# Altium schematic sheet 06-Audio.SchDoc
size A3
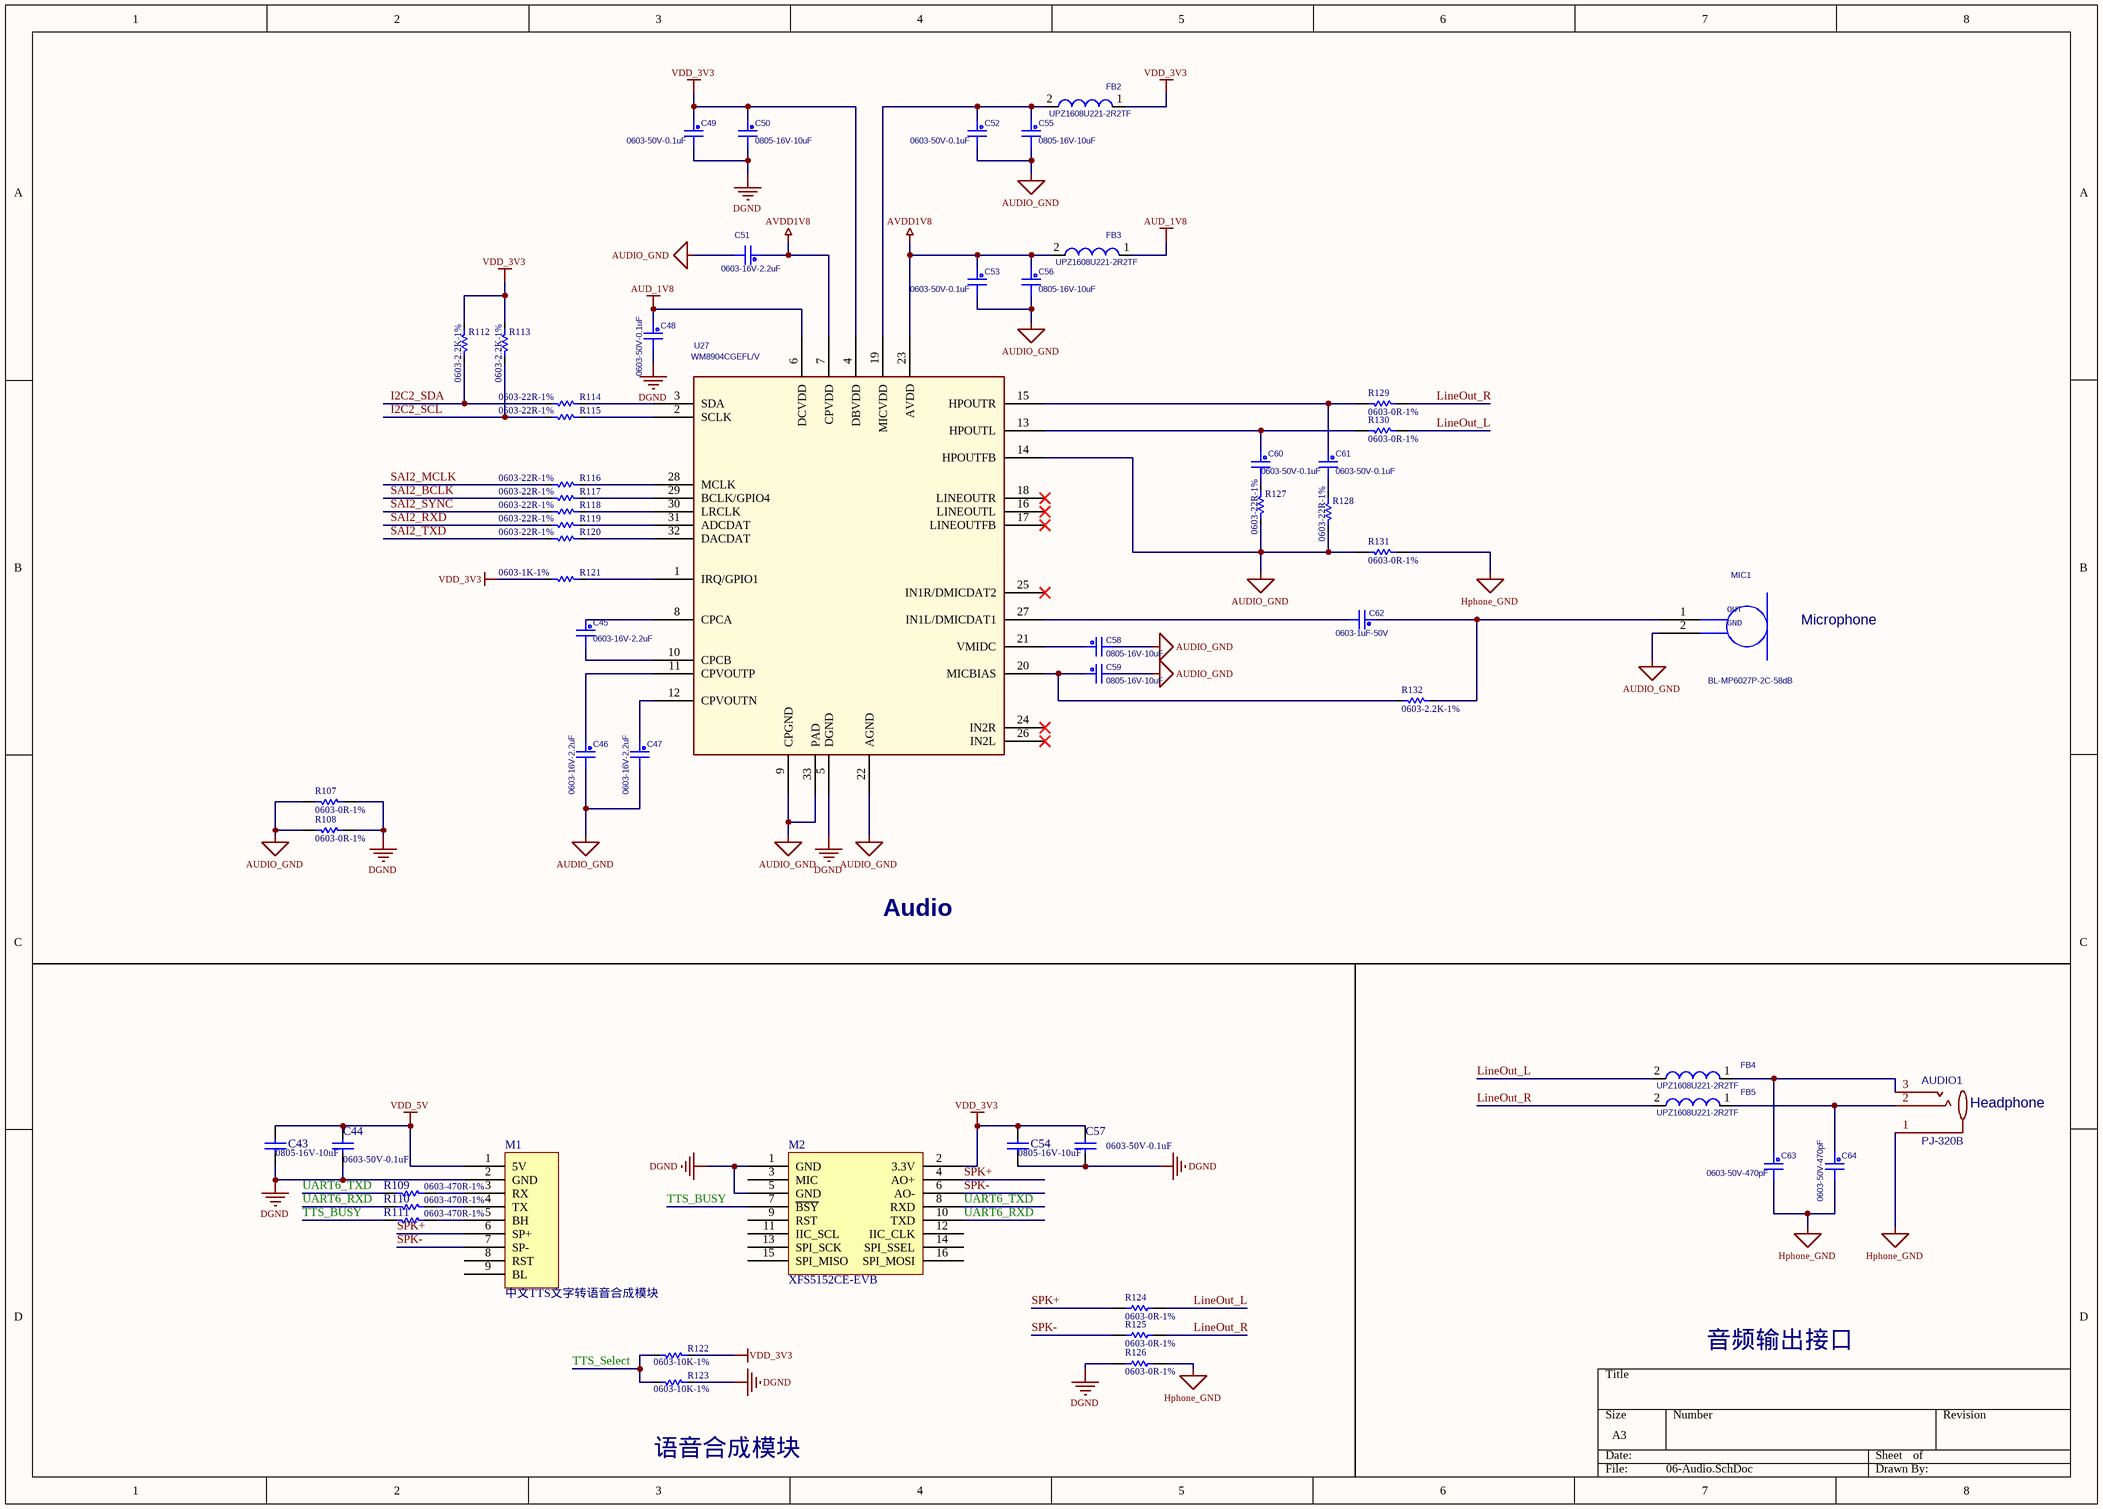
[diagram p0: 06-Audio.SchDoc]

## Parts
AUDIO1  PJ-320B  [PJ-320B]
C43  0805-16V-10uF  [0805C - 3D]
C44  0603-50V-0.1uF  [0603C]
C45  0603-16V-2.2uF  [0603C]
C46  0603-16V-2.2uF  [0603C]
C47  0603-16V-2.2uF  [0603C]
C48  0603-50V-0.1uF  [0603C]
C49  0603-50V-0.1uF  [0603C]
C50  0805-16V-10uF  [0603C]
C51  0603-16V-2.2uF  [0603C]
C52  0603-50V-0.1uF  [0603C]
C53  0603-50V-0.1uF  [0603C]
C54  0805-16V-10uF  [0805C - 3D]
C55  0805-16V-10uF  [0603C]
C56  0805-16V-10uF  [0603C]
C57  0603-50V-0.1uF  [0603C]
C58  0805-16V-10uF  [0603C]
C59  0805-16V-10uF  [0603C]
C60  0603-50V-0.1uF  [0603C]
C61  0603-50V-0.1uF  [0603C]
C62  0603-1uF-50V  [0603C]
C63  0603-50V-470pF  [0603C]
C64  0603-50V-470pF  [0603C]
FB2  UPZ1608U221-2R2TF  [0603L]
FB3  UPZ1608U221-2R2TF  [VLCF5020T]
FB4  UPZ1608U221-2R2TF  [0603L]
FB5  UPZ1608U221-2R2TF  [0603L]
M1  中文TTS文字转语音合成模块
M2  XFS5152CE-EVB  [XFS5152CE_V1.1]
MIC1  BL-MP6027P-2C-58dB  [MP6027P]
R107  0603-0R-1%  [0603R]
R108  0603-0R-1%  [0603R]
R109  0603-470R-1%  [0603R]
R110  0603-470R-1%  [0603R]
R111  0603-470R-1%  [0603R]
R112  0603-2.2K-1%  [0603R]
R113  0603-2.2K-1%  [0603R]
R114  0603-22R-1%  [0603R]
R115  0603-22R-1%  [0603R]
R116  0603-22R-1%  [0603R]
R117  0603-22R-1%  [0603R]
R118  0603-22R-1%  [0603R]
R119  0603-22R-1%  [0603R]
R120  0603-22R-1%  [0603R]
R121  0603-1K-1%  [0603R]
R122  0603-10K-1%  [0603R]
R123  0603-10K-1%  [0603R]
R124  0603-0R-1%  [0603R]
R125  0603-0R-1%  [0603R]
R126  0603-0R-1%  [0603R]
R127  0603-22R-1%  [0603R]
R128  0603-22R-1%  [0603R]
R129  0603-0R-1%  [0603R]
R130  0603-0R-1%  [0603R]
R131  0603-0R-1%  [0603R]
R132  0603-2.2K-1%  [0603R]
U27  WM8904CGEFL/V  [qfn32-0_4]

## Nets
AUD_1V8: C48.1 FB3.1 U27.6(DCVDD)
AUDIO_GND: C46.2 C47.2 C51.2 C52.2 C53.2 C55.2 C56.2 C58.2 C59.2 MIC1.2(GND) R107.1 R108.1 R127.1 R128.1 R131.1 U27.9(CPGND) U27.14(HPOUTFB) U27.22(AGND) U27.33(PAD)
AVDD1V8: C51.1 C53.1 C56.1 FB3.2 U27.7(CPVDD) U27.23(AVDD)
DGND: C43.2 C44.2 C48.2 C49.2 C50.2 C54.2 C57.2 M1.2(GND) M2.1(GND) M2.5(GND) R107.2 R108.2 R123.2 R126.2 U27.5(DGND)
Hphone_GND: AUDIO1.1 C63.2 C64.2 R126.1 R131.2
VDD_3V3: C49.1 C50.1 C54.1 C57.1 FB2.1 M2.2(3.3V) R112.2 R113.2 R121.1 R122.2 U27.4(DBVDD)
VDD_5V: C43.1 C44.1 M1.1(5V)
I2C2_SCL: R113.1 R115.1
I2C2_SDA: R112.1 R114.1
LineOut_L: FB4.2 R124.1 R130.2
LineOut_R: FB5.2 R125.1 R129.2
SAI2_BCLK: R117.1
SAI2_MCLK: R116.1
SAI2_RXD: R119.1
SAI2_SYNC: R118.1
SAI2_TXD: R120.1
SPK+: M1.6(SP+) M2.4(AO+) R124.2
SPK-: M1.7(SP-) M2.6(AO-) R125.2
TTS_BUSY: M2.7(~{BSY}) R111.2
TTS_Select: R122.1 R123.1
UART6_RXD: M2.10(TXD) R110.2
UART6_TXD: M2.8(RXD) R109.2
NetAUDIO1_2: AUDIO1.2 C64.1 FB5.1
NetAUDIO1_3: AUDIO1.3 C63.1 FB4.1
NetC45_1: C45.1 U27.8(CPCA)
NetC45_2: C45.2 U27.10(CPCB)
NetC46_1: C46.1 U27.11(CPVOUTP)
NetC47_1: C47.1 U27.12(CPVOUTN)
NetC52_1: C52.1 C55.1 FB2.2 U27.19(MICVDD)
NetC58_1: C58.1 U27.21(VMIDC)
NetC59_1: C59.1 R132.2 U27.20(MICBIAS)
NetC60_1: C60.1 R130.1 U27.13(HPOUTL)
NetC60_2: C60.2 R127.2
NetC61_1: C61.1 R129.1 U27.15(HPOUTR)
NetC61_2: C61.2 R128.2
NetC62_1: C62.1 MIC1.1(OUTPUT) R132.1
NetC62_2: C62.2 U27.27(IN1L/DMICDAT1)
NetM1_3: M1.3(RX) R109.1
NetM1_4: M1.4(TX) R110.1
NetM1_5: M1.5(BH) R111.1
NetR114_2: R114.2 U27.3(SDA)
NetR115_2: R115.2 U27.2(SCLK)
NetR116_2: R116.2 U27.28(MCLK)
NetR117_2: R117.2 U27.29(BCLK/GPIO4)
NetR118_2: R118.2 U27.30(LRCLK)
NetR119_2: R119.2 U27.31(ADCDAT)
NetR120_2: R120.2 U27.32(DACDAT)
NetR121_2: R121.2 U27.1(IRQ/GPIO1)

Not connected (* = marked no-connect by the designer): M1 8(RST) 9(BL); M2 3(MIC) 9(RST) 11(IIC_SCL) 12(IIC_CLK) 13(SPI_SCK) 14(SPI_SSEL) 15(SPI_MISO) 16(SPI_MOSI); U27 16(LINEOUTL)* 17(LINEOUTFB)* 18(LINEOUTR)* 24(IN2R)* 25(IN1R/DMICDAT2)* 26(IN2L)*

## Notes on the sheet
- Microphone
- Audio
- (near AUDIO1) Headphone
- 音频输出接口
- 语音合成模块
- (in symbol MIC) OUT

## Library data of the parts
AUDIO1 = (no symbol name): BOM_Manufacturer: BOOMELE; Contributor: LCSC; BOM_Supplier: LCSC; BOM_Manufacturer Part: PJ-320B; BOM_Supplier Part: C18594; spicePre: A
C43 C54 = Cap: Capacitor; Value: 10nF; Published: 8-Jun-2000; Revision: July-2002: Re-released for DXP Platform.; Publisher: Altium Limited
C44 C57 = Cap: Capacitor; Published: 8-Jun-2000; LatestRevisionDate: 17-Jul-2002; LatestRevisionNote: Re-released for DXP Platform.; PackageReference: RAD-0.3; Publisher: Altium Limited; Value: 0603-50V-0.1UF
C45-C53 C55 C56 C58-C64 = CERAMIC CAPACITOR: Ceramic Capacitor, +/-10%,X7R,SMD; Manufacturer: Murata; Manufacturer P/N: GRM31CR61C226KE15L; Myir P/N: 2040100002; Reserve Value: 22uF; Part Type: Ceramic Capacitor; Datasheet: Ceramic Capacitor.pdf
FB2 = Inductor_Dup1: Ferrite Bead,220R@100Mhz, 2000mA,+/-25%,SMD,0603; Manufacturer P/N: BLM21PG221SN1D; Manufacturer: Murata; Reserve Value: 220R; Myir P/N: 2060100003; Datasheet: BLM21P.pdf; Part Type: Ferrite Bead
FB3-FB5 = Inductor_Dup1: Ferrite Bead,220R@100Mhz, 2000mA,+/-25%,SMD,0805; Manufacturer P/N: BLM21PG221SN1D; Manufacturer: Murata; Reserve Value: 220R; Myir P/N: 2060100003; Datasheet: BLM21P.pdf; Part Type: Ferrite Bead
M1 = 中文TTS文字转语音合成模块: 中文TTS文字转语音合成模块,替代SYN6288和XFS5152
M2 = XFS5152CE-EVB: 科大讯飞语音合成模块 XFS5152CE-V1.1
MIC1 = MIC: Microphone Signal to noise ration　≥58　Dimensionφ6.0x2.7; Manufacturer: HUALIAN; Myir P/N: 2130300001; Datasheet: BL-MP6027P-2C-58dB.pdf; Reserve Value: BL-MP6027P-2C-58dB; Manufacturer P/N: BL-MP6027P-2C-58dB; Part Type: Connector
R107 R108 R112-R132 = Res1: Resistor; Value: 1K; Published: 8-Jun-2000; LatestRevisionDate: 17-Jul-2002; LatestRevisionNote: Re-released for DXP Platform.; PackageReference: AXIAL-0.3; Publisher: Altium Limited
R109-R111 = Res1: Resistor; Value: 0603-10K-1%; Published: 8-Jun-2000; LatestRevisionDate: 17-Jul-2002; LatestRevisionNote: Re-released for DXP Platform.; PackageReference: AXIAL-0.3; Publisher: Altium Limited
U27 = WM8904: IC,Ultra Low Power CODEC for Portable Audio Applications,SMD,QFN-32; Manufacturer: Wolfson; Myir P/N: 2010700025; Reserve Value: WM8904CGEFL/V; Manufacturer P/N: WM8904CGEFL/V; Part Type: Interface; Datasheet: WM8904.pdf